# Altium project 绘蓝杯小闹钟.PrjPcb
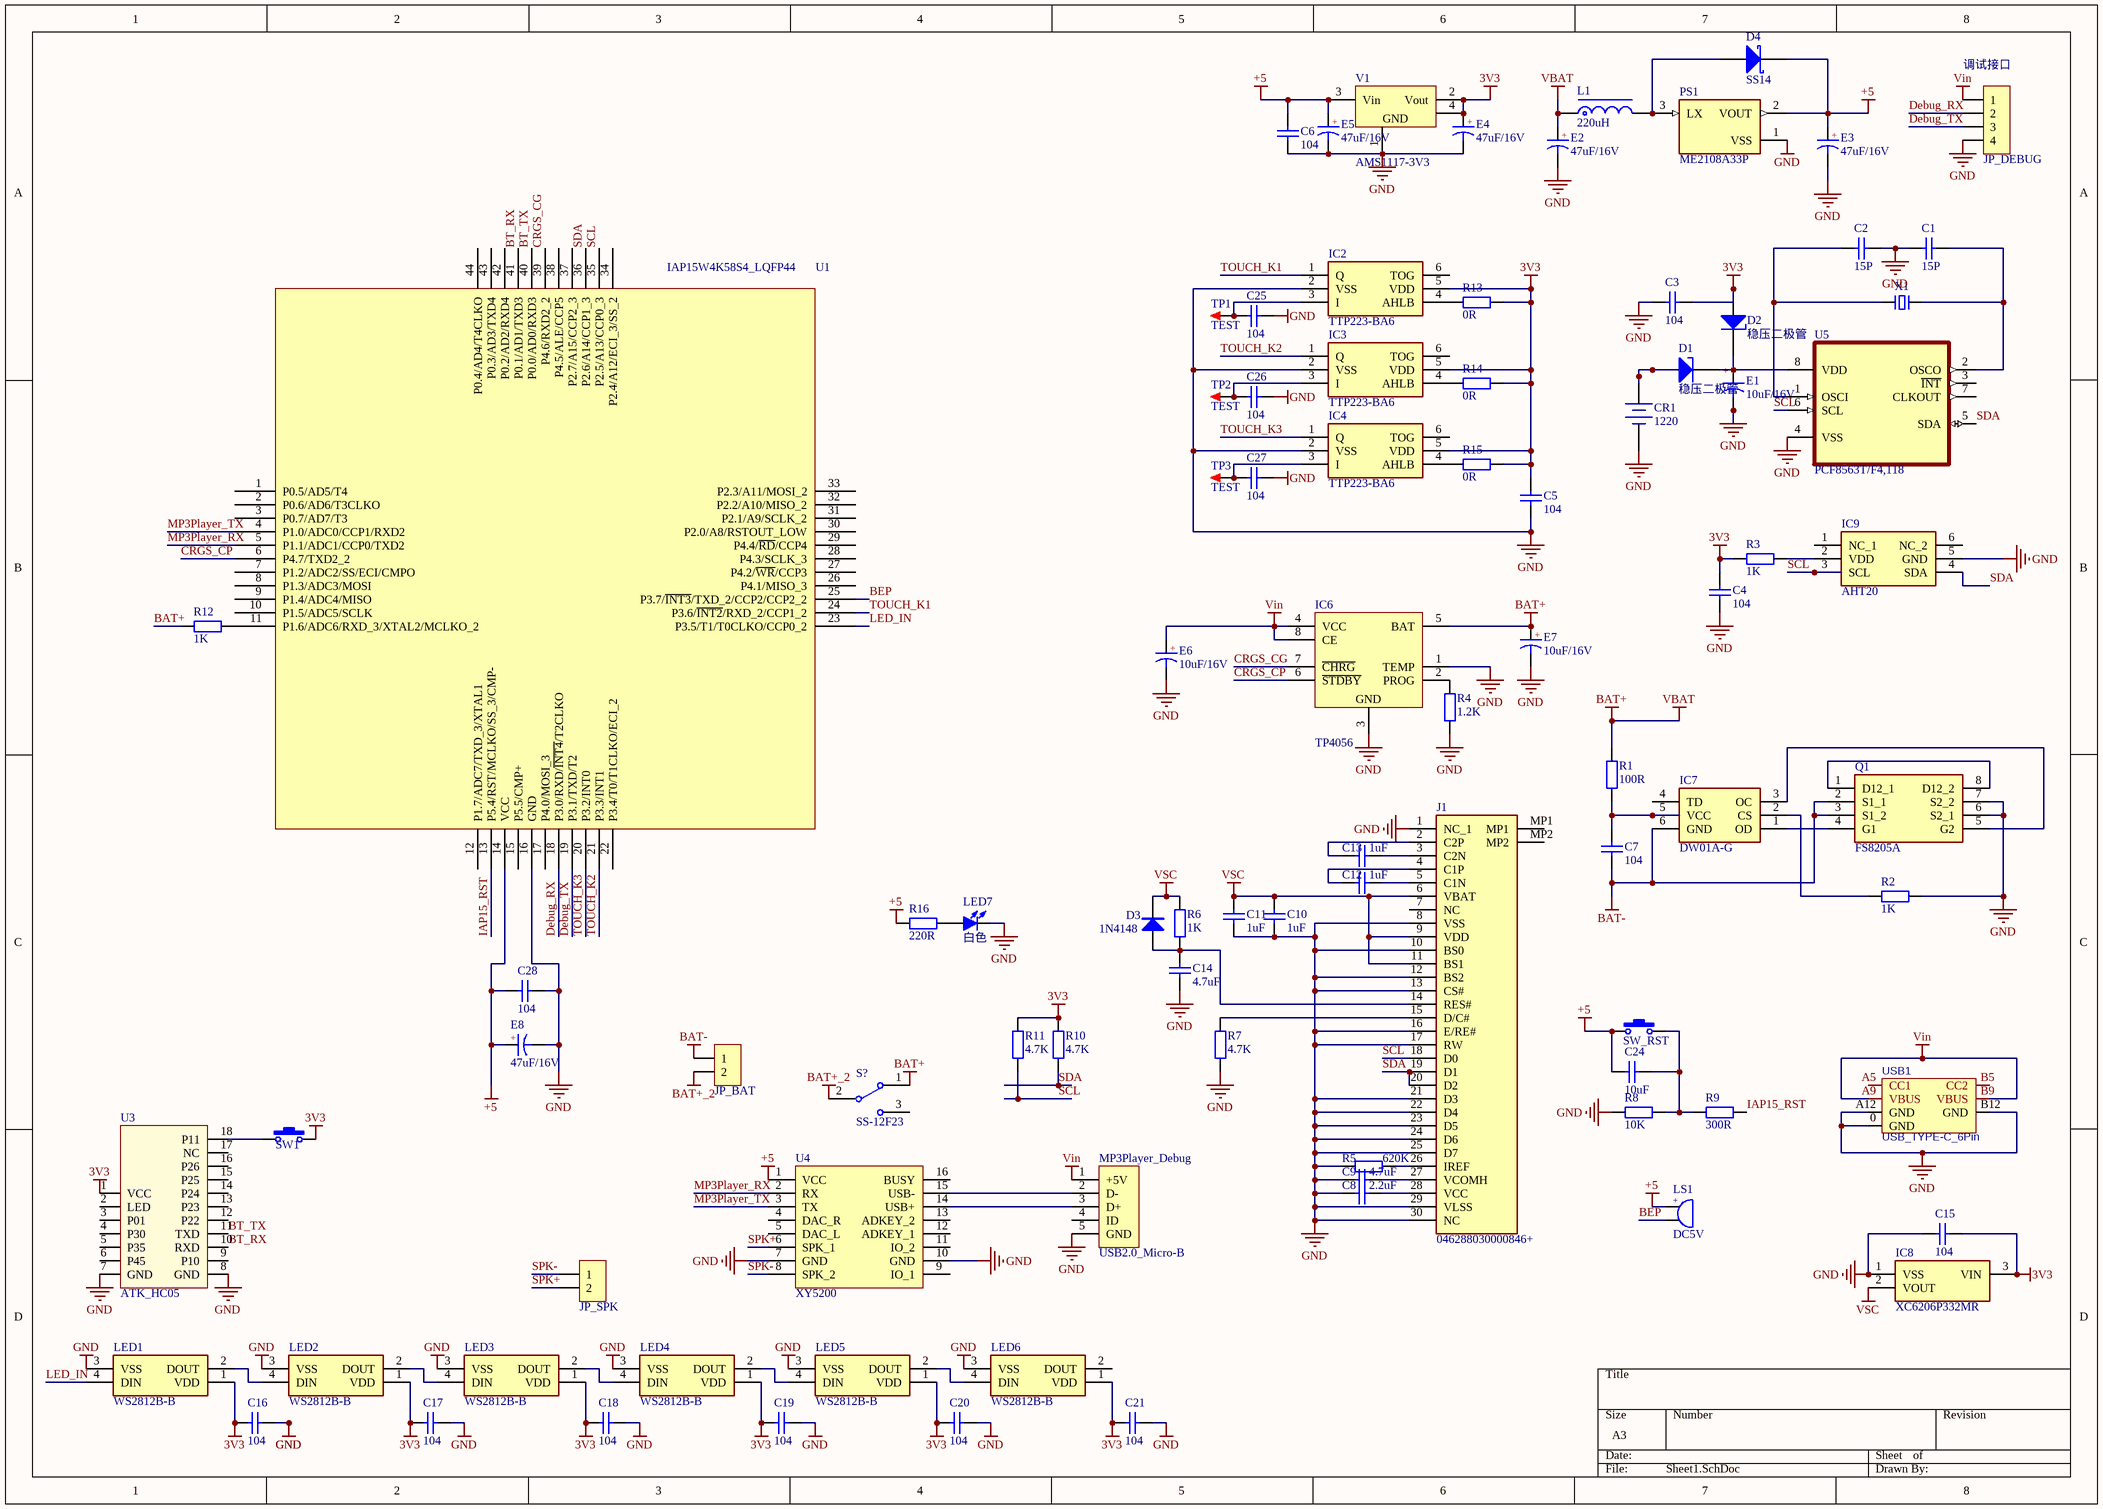
[diagram p0: Sheet1.SchDoc]
1 sheet, 91 parts. Net scope: global (net labels, ports and power ports of the same name join across sheets).
Board file: 删除机械层.PcbDoc

## Sheet Sheet1.SchDoc
size A3; SheetNumber: 1; SheetTotal: 1

### Parts
C1  15P  [C0805_L]
C2  15P  [C0805_L]
C3  104  [C0805_L]
C4  104  [C0805_L]
C5  104  [C0805_L]
C6  104  [C0805_L]
C7  104  [C0805_L]
C8  2.2uF  [C0805_L]
C9  4.7uF  [C0805_L]
C10  1uF  [C0805_L]
C11  1uF  [C0805_L]
C12  1uF  [C0805_L]
C13  1uF  [C0805_L]
C14  4.7uF  [C0805_L]
C15  104  [C0805_L]
C16  104  [C0805_L]
C17  104  [C0805_L]
C18  104  [C0805_L]
C19  104  [C0805_L]
C20  104  [C0805_L]
C21  104  [C0805_L]
C24  10uF  [C0805_L]
C25  104  [C0805_L]
C26  104  [C0805_L]
C27  104  [C0805_L]
C28  104  [C0805_L]
CR1  1220  [CR1220_A]
D1  稳压二极管  [SOD-123]
D2  稳压二极管  [SOD-123]
D3  1N4148  [MINI_MELF (LL34)]
D4  SS14  [SMA]
E1  10uF/16V  [CE B(4*5.4)]
E2  47uF/16V  [CE C(5*5.4)]
E3  47uF/16V  [CE C(5*5.4)]
E4  47uF/16V  [CE C(5*5.4)]
E5  47uF/16V  [CE C(5*5.4)]
E6  10uF/16V  [CE B(4*5.4)]
E7  10uF/16V  [CE B(4*5.4)]
E8  47uF/16V  [CE C(5*5.4)]
IC2  TTP223-BA6  [SOT95P285X126-6N]
IC3  TTP223-BA6  [SOT95P285X126-6N]
IC4  TTP223-BA6  [SOT95P285X126-6N]
IC6  TP4056  [SOIC-8_EP]
IC7  DW01A-G  [SOT95P280X135-6N]
IC8  XC6206P332MR  [SOT95P280X130-3N]
IC9  AHT20  [AHT20]
J1  046288030000846+  [046288030000846]
JP_BAT  HDR-1X2  [XH2.54-LI-2P]  (value not drawn)
JP_DEBUG  HDR-1X4  [HDR2.54-WI-4P]  (value not drawn)
JP_SPK  HDR-1X2  [XH2.54-LI-2P]  (value not drawn)
L1  220uH  [CD54]
LED1  WS2812B-B  [WS2812BB]
LED2  WS2812B-B  [WS2812BB]
LED3  WS2812B-B  [WS2812BB]
LED4  WS2812B-B  [WS2812BB]
LED5  WS2812B-B  [WS2812BB]
LED6  WS2812B-B  [WS2812BB]
LED7  白色  [LED0805_W]
LS1  DC5V  [BEEP 5x9x5.5]
MP3Player_Debug  USB2.0_Micro-B  [USB2.0_MICRO-B_4]
PS1  ME2108A33P  [CONV_ME2108A33P]
Q1  FS8205A  [SOP65P640X120-8N]
R1  100R  [R0805_L]
R2  1K  [R0805_L]
R3  1K  [R0805_L]
R4  1.2K  [R0805_L]
R5  620K  [R0805_L]
R6  1K  [R0805_L]
R7  4.7K  [R0805_L]
R8  10K  [R0805_L]
R9  300R  [R0805_L]
R10  4.7K  [R0805_L]
R11  4.7K  [R0805_L]
R12  1K  [R0805_L]
R13  0R  [R0805_L]
R14  0R  [R0805_L]
R15  0R  [R0805_L]
R16  220R  [R0805_L]
S?  SS-12F23  [MSK-12C01-07]
SW1  3x6x5  [SW SMD-3*6*2.5]  (value not drawn)
SW_RST  3x6x5  [SW SMD-3*6*2.5]  (value not drawn)
TP1  TEST  [TEST 1.6]
TP2  TEST  [TEST 1.6]
TP3  TEST  [TEST 1.6]
U1  IAP15W4K58S4_LQFP44  [LQFP44]
U3  ATK_HC05  [ATK_HC05]
U4  XY5200  [DFPlayer Mini]
U5  PCF8563T/F4,118  [SOIC127P600X175-8N]
USB1  USB_TYPE-C_6Pin  [USB-C-SMD_6P]
V1  AMS1117-3V3  [SOT223_L]
X1  (no value)  [XTAL-3215-2P]

### Nets
3V3: C3.2 C4.2 C5.2 C15.2 C16.1 C17.1 C18.1 C19.1 C20.1 C21.1 D2.1(A) E4.1 IC2.5(VDD) IC3.5(VDD) IC4.5(VDD) IC8.3(VIN) LED1.1(VDD) LED2.1(VDD) LED3.1(VDD) LED4.1(VDD) LED5.1(VDD) LED6.1(VDD) R3.1 R10.2 R11.2 R13.2 R14.2 R15.2 SW1.2 U3.1(VCC) V1.2(Vout) V1.4(GND)
+5: C6.2 C24.1 C28.1 D4.2(K) E3.1 E5.1 E8.1 LS1.1 PS1.2(VOUT) R16.1 SW_RST.1 U1.14(VCC) U4.1(VCC) V1.3(Vin)
BAT+: E2.1 E7.1 IC6.5(BAT) L1.1 R1.2 R12.1 S?.1  [also labelled VBAT]
BAT+_2: JP_BAT.2 S?.2
BAT-: C7.1 IC7.6(GND) JP_BAT.1 Q1.2(S1_1) Q1.3(S1_2)
GND: C1.1 C2.2 C3.1 C4.1 C5.1 C6.1 C8.1 C9.1 C10.1 C11.1 C14.1 C15.1 C16.2 C17.2 C18.2 C19.2 C20.2 C21.2 C25.2 C26.2 C27.2 C28.2 CR1.2(DC-) E1.2 E2.2 E3.2 E4.2 E5.2 E6.2 E7.2 E8.2 IC2.2(VSS) IC3.2(VSS) IC4.2(VSS) IC6.1(TEMP) IC6.3(GND) IC8.1(VSS) IC9.5(GND) J1.1(NC_1) J1.8(VSS) J1.10(BS0) J1.12(BS2) J1.13(CS#) J1.16(E/RE#) J1.17(RW) J1.21(D3) J1.22(D4) J1.23(D5) J1.24(D6) J1.25(D7) J1.29(VLSS) J1.30(NC) JP_DEBUG.4 LED1.3(VSS) LED2.3(VSS) LED3.3(VSS) LED4.3(VSS) LED5.3(VSS) LED6.3(VSS) LED7.2(K) MP3Player_Debug.5(GND) PS1.1(VSS) Q1.6(S2_1) Q1.7(S2_2) R2.2 R4.1 R5.1 R7.1 R8.1 U1.16(GND) U3.7(GND) U3.8(GND) U4.7(GND) U4.10(GND) U5.4(VSS) USB1.0(GND) USB1.A12(GND) USB1.B12(GND) V1.1(GND)
Vin: E6.1 IC6.4(VCC) IC6.8(CE) JP_DEBUG.1 MP3Player_Debug.1(+5V) USB1.A9(VBUS) USB1.B9(VBUS)
VSC: C10.2 C11.2 D3.2(K) IC8.2(VOUT) J1.6(VBAT) J1.9(VDD) J1.11(BS1) R6.2
BEP: LS1.2 U1.25(P3.7/~{INT3}/TXD_2/CCP2/CCP2_2)
BT_RX: U1.41(P0.1/AD1/TXD3) U3.10(RXD)
BT_TX: U1.40(P0.0/AD0/RXD3) U3.11(TXD)
CRGS_CG: IC6.7(~{CHRG}) U1.39(P4.6/RXD2_2)
CRGS_CP: IC6.6(~{STDBY}) U1.6(P4.7/TXD2_2)
Debug_RX: JP_DEBUG.2 U1.18(P3.0/RXD/~{INT4}/T2CLKO)
Debug_TX: JP_DEBUG.3 U1.19(P3.1/TXD/T2)
IAP15_RST: R9.2 U1.13(P5.4/RST/MCLKO/SS_3/CMP-)
LED_IN: LED1.4(DIN) U1.23(P3.5/T1/T0CLKO/CCP0_2)
MP3Player_RX: U1.5(P1.1/ADC1/CCP0/TXD2) U4.2(RX)
MP3Player_TX: U1.4(P1.0/ADC0/CCP1/RXD2) U4.3(TX)
SCL: IC9.3(SCL) J1.18(D0) R11.1 U1.35(P2.5/A13/CCP0_3) U5.6(SCL)
SDA: IC9.4(SDA) J1.19(D1) J1.20(D2) R10.1 U1.36(P2.6/A14/CCP1_3) U5.5(SDA)
SPK+: JP_SPK.2 U4.6(SPK_1)
SPK-: JP_SPK.1 U4.8(SPK_2)
TOUCH_K1: IC2.1(Q) U1.24(P3.6/~{INT2}/RXD_2/CCP1_2)
TOUCH_K2: IC3.1(Q) U1.21(P3.3/INT1)
TOUCH_K3: IC4.1(Q) U1.20(P3.2/INT0)
NetC1_2: C1.2 U5.2(OSCO) X1.2
NetC2_1: C2.1 U5.1(OSCI) X1.1
NetC7_2: C7.2 IC7.5(VCC) R1.1
NetC8_2: C8.2 J1.28(VCC)
NetC9_2: C9.2 J1.27(VCOMH)
NetC12_1: C12.1 J1.4(C1P)
NetC12_2: C12.2 J1.5(C1N)
NetC13_1: C13.1 J1.2(C2P)
NetC13_2: C13.2 J1.3(C2N)
NetC14_2: C14.2 D3.1(A) J1.14(RES#) R6.1
NetC24_2: C24.2 R8.2 R9.1 SW_RST.2
NetC25_1: C25.1 IC2.3(I) TP1.1
NetC26_1: C26.1 IC3.3(I) TP2.1
NetC27_1: C27.1 IC4.3(I) TP3.1
NetCR1_1: CR1.1(DC+) D1.1(A)
NetD1_2: D1.2(K) D2.2(K) E1.1 U5.8(VDD)
NetD4_1: D4.1(A) L1.2 PS1.3(LX)
NetIC2_4: IC2.4(AHLB) R13.1
NetIC3_4: IC3.4(AHLB) R14.1
NetIC4_4: IC4.4(AHLB) R15.1
NetIC6_2: IC6.2(PROG) R4.2
NetIC7_1: IC7.1(OD) Q1.4(G1)
NetIC7_2: IC7.2(CS) R2.1
NetIC7_3: IC7.3(OC) Q1.5(G2)
NetIC9_2: IC9.2(VDD) R3.2
NetJ1_15: J1.15(D/C#) R7.2
NetJ1_26: J1.26(IREF) R5.2
NetLED1_2: LED1.2(DOUT) LED2.4(DIN)
NetLED2_2: LED2.2(DOUT) LED3.4(DIN)
NetLED3_2: LED3.2(DOUT) LED4.4(DIN)
NetLED4_2: LED4.2(DOUT) LED5.4(DIN)
NetLED5_2: LED5.2(DOUT) LED6.4(DIN)
NetLED7_1: LED7.1(A) R16.2
NetMP3Player_Debug_2: MP3Player_Debug.2(D-) U4.15(USB-)
NetMP3Player_Debug_3: MP3Player_Debug.3(D+) U4.14(USB+)
NetQ1_1: Q1.1(D12_1) Q1.8(D12_2)
NetR12_2: R12.2 U1.11(P1.6/ADC6/RXD_3/XTAL2/MCLKO_2)
NetSW1_1: SW1.1 U3.18(P11)

Not connected (* = marked no-connect by the designer): IC2 6(TOG); IC3 6(TOG); IC4 6(TOG); IC7 4(TD); IC9 1(NC_1) 6(NC_2); J1 7(NC) MP1 MP2; LED6 2(DOUT); MP3Player_Debug 4(ID); S? 3; U1 1(P0.5/AD5/T4) 2(P0.6/AD6/T3CLKO) 3(P0.7/AD7/T3) 7(P1.2/ADC2/SS/ECI/CMPO) 8(P1.3/ADC3/MOSI) 9(P1.4/ADC4/MISO) 10(P1.5/ADC5/SCLK) 12(P1.7/ADC7/TXD_3/XTAL1) 15(P5.5/CMP+) 17(P4.0/MOSI_3) 22(P3.4/T0/T1CLKO/ECI_2) 26(P4.1/MISO_3) 27(P4.2/~{WR}/CCP3) 28(P4.3/SCLK_3) 29(P4.4/~{RD}/CCP4) 30(P2.0/A8/RSTOUT_LOW) 31(P2.1/A9/SCLK_2) 32(P2.2/A10/MISO_2) 33(P2.3/A11/MOSI_2) 34(P2.4/A12/ECI_3/SS_2) 37(P2.7/A15/CCP2_3) 38(P4.5/ALE/CCP5) 42(P0.2/AD2/RXD4) 43(P0.3/AD3/TXD4) 44(P0.4/AD4/T4CLKO); U3 2(LED) 3(P01) 4(P30) 5(P35) 6(P45) 9(P10) 12(P22) 13(P23) 14(P24) 15(P25) 16(P26) 17(NC); U4 4(DAC_R) 5(DAC_L) 9(IO_1) 11(IO_2) 12(ADKEY_1) 13(ADKEY_2) 16(BUSY); U5 3(~{INT}) 7(CLKOUT); USB1 A5(CC1) B5(CC2)

### Notes on the sheet
- (near JP_DEBUG) 调试接口
- (in symbol BEEP) +
- (in symbol CE_SMD) +

### Library data of the parts
C1-C21 C24-C28 = C: 贴片电容; BOM名称: 无极性贴片电容; 联系卖家，免费查找封装: 唯一出售店铺网址https://shop463601444.taobao.com
CR1 = CR-3V: 微型电池; 联系卖家，免费查找封装: 唯一出售店铺网址https://shop463601444.taobao.com; 封装库来自淘宝卖家ID：黄晶宝石: 其他店铺购入均为盗版假冒封装库，请立即申请退款; BOM名称: 微型电池
D1 D2 = 稳压二极管: Zener Diode; 联系卖家，免费查找封装: 唯一出售店铺网址https://shop463601444.taobao.com
D3 = 1N4148: 开关二极管; BOM名称: 高速开关二极管; 联系卖家，免费查找封装: 唯一出售店铺网址https://shop463601444.taobao.com
D4 = SS14: 肖特基二极管; 属性: 40V/1A; 联系卖家，免费查找封装: 唯一出售店铺网址https://shop463601444.taobao.com; BOM名称: 肖特基二极管
E1-E8 = CE_SMD: 贴片电解电容; 联系卖家，免费查找封装: 唯一出售店铺网址https://shop463601444.taobao.com; BOM名称: 贴片电解电容
IC2-IC4 = TTP223-BA6: Integrated Circuit; Manufacturer_Name: TONTEK; Datasheet Link: https://radiokot.ru/konkursCatDay2014/53/01.pdf; Height: 1.26mm; Manufacturer_Part_Number: TTP223-BA6
IC6 = TP4056: 锂电池充电管理; 封装库来自淘宝卖家 ID：黄晶宝石: 其他店铺购入均为盗版，请立即申请退款，本店现金奖励5~20元; 联系卖家 免费查找封装: 唯一出售店铺网址https://shop463601444.taobao.com; BOM名称: 锂电池充电管理
IC7 = DW01A-G: Integrated Circuit; Manufacturer_Name: Fortune Semiconductor Corporation; Datasheet Link: http://acoptex.com/uploads/DW01A.pdf; Height: 1.35mm; Manufacturer_Part_Number: DW01A-G
IC8 = XC6206P332MR: Integrated Circuit; Manufacturer_Name: Torex; Datasheet Link: http://www.torexsemi.com/products/voltage_regulators/data/XC6206.pdf; Height: 1.3mm; Manufacturer_Part_Number: XC6206P332MR
IC9 = AHT20: Integrated Circuit; Manufacturer_Name: Adafruit; Datasheet Link: https://cdn-learn.adafruit.com/assets/assets/000/091/676/original/AHT20-datasheet-2020-4-16.pdf?1591047915; Height: 1.1mm; Manufacturer_Part_Number: AHT20
J1 = 046288030000846+: Connector; Manufacturer_Name: Kyocera Electronic Components; Datasheet Link: https://global.kyocera.com/prdct/electro/product/pdf/6288.pdf; Height: 2.15mm; Manufacturer_Part_Number: 046288030000846+; Mouser Part Number: 581-046288030000846+; Mouser Price/Stock: https://www.mouser.co.uk/ProductDetail/Kyocera-Electronic-Components/046288030000846%2b?qs=HmNO9%252B%2F6HD5kPR%2FYbA40zA%3D%3D
JP_BAT JP_SPK = Header 2: 2P接插件; 封装库来自淘宝卖家 ID：黄晶宝石: 其他店铺购入均为盗版假冒封装库; 联系卖家，免费查找封装: 唯一出售店铺网址https://shop463601444.taobao.com; BOM名称: 2P接插件
JP_DEBUG = Header 4: 4P接插件; 封装库来自淘宝卖家 ID：黄晶宝石: 其他店铺购入均为盗版假冒封装库; 联系卖家，免费查找封装: 唯一出售店铺网址https://shop463601444.taobao.com; BOM名称: 4P接插件
L1 = L-SMD: CD系列贴片线绕功率电感; BOM名称: 功率电感; 联系卖家，免费查找封装: 唯一出售店铺网址https://shop463601444.taobao.com
LED1-LED6 = WS2812B-B: LED; Manufacturer_Name: Worldsemi; Datasheet Link: http://www.world-semi.com/DownLoadFile/111; Height: 1.62mm; Manufacturer_Part_Number: WS2812B-B
LED7 = LED-SMD: 贴片LED; 联系卖家 免费查找封装: 封装库来自淘宝卖家ID：黄晶宝石; BOM名称: 贴片LED
LS1 = BEEP: 蜂鸣器; 联系卖家，免费查找封装: 唯一出售店铺网址https://shop463601444.taobao.com; 封装库来自淘宝卖家ID：黄晶宝石: 其他店铺购入均为盗版假冒封装库，请立即申请退款; BOM名称: 蜂鸣器
MP3Player_Debug = USB2.0_Micro-B: USB2.0_Micro-B母座; 联系卖家 免费查找封装: 唯一出售店铺网址https://shop463601444.taobao.com; 联系卖家 免费技术支持: 封装库来自淘宝卖家ID：黄晶宝石; BOM名称: USB2.0_Micro-B母座
PS1 = ME2108A33P: PFM Step-up Step-up Step-up Step-up DC/DC Converter; MF: Nanjing Micro One Electronics; Price: None; SnapEDA_Link: https://www.snapeda.com/parts/ME2108A33P/Nanjing%20Micro%20One%20Electronics/view-part/4258047/?ref=snap; MP: ME2108A33P; Value: *; Availability: Unavailable; Package: Package; Check_prices: https://www.snapeda.com/parts/ME2108A33P/Nanjing%20Micro%20One%20Electronics/view-part/4258047/?ref=eda
Q1 = FS8205A: MOSFET (N-Channel); Manufacturer_Name: fortune; Datasheet Link: http://www.ic-fortune.com/upload/Download/FS8205A-DS-12_EN.pdf; Height: 1.2mm; Manufacturer_Part_Number: FS8205A
R1-R16 = R: 贴片电阻; 联系卖家，免费查找封装: 唯一出售店铺网址https://shop463601444.taobao.com; BOM名称: 贴片电阻
S? = SSW-1P: 1路波动开关; BOM名称: 波动开关; 联系卖家，免费查找封装: 唯一出售店铺网址https://shop463601444.taobao.com; 封装库来自淘宝卖家ID：黄晶宝石: 其他店铺购入均为盗版假冒封装库，请立即申请退款
SW1 SW_RST = SW 3x6: 3x6轻触开关; 联系卖家，免费查找封装: 唯一出售店铺网址https://shop463601444.taobao.com; 封装库来自淘宝卖家ID：黄晶宝石: 其他店铺购入均为盗版假冒封装库，请立即申请退款; BOM名称: 3x6轻触开关
TP1-TP3 = TEST: 测试点; 联系卖家，免费查找封装: 唯一出售店铺网址https://shop463601444.taobao.com; 封装库来自淘宝卖家ID：黄晶宝石: 其他店铺购入均为盗版假冒封装库，请立即申请退款; BOM名称: 测试点
U1 = STC15W4K60S4_LQFP44
U3 = ATK_HC05: 蓝牙模块; 联系卖家，免费查找封装: 唯一出售店铺网址https://shop463601444.taobao.com
U4 = Mini MP3 Player: MP3模块; 卖家免费技术支持，联系售后: 唯一出售店铺网址https://shop463601444.taobao.com; BOM名称: MP3模块
U5 = PCF8563T/F4,118: Real Time Clock (RTC) IC Clock/Calendar IÂ²C, 2-Wire Serial 8-SOIC (0.154, 3.90mm Width); MF: NXP USA; Value: *; Price: None; Check_prices: https://www.snapeda.com/parts/PCF8563T/F4,118/NXP%20USA%20Inc./view-part/32409/?ref=eda; Purchase-URL: https://pricing.snapeda.com/search/part/PCF8563T/F4,118/?ref=eda; MP: PCF8563T/F4,118; SnapEDA_Link: https://www.snapeda.com/parts/PCF8563T/F4,118/NXP%20USA%20Inc./view-part/32409/?ref=snap; Package: SOIC-8 NXP Semiconductors; Availability: Good
USB1 = USB_TYPE-C_6Pin: USB_TYPE-C_6Pin母座; 联系卖家 免费查找封装: 唯一出售店铺网址https://shop463601444.taobao.com; 联系卖家 免费技术支持: 封装库来自淘宝卖家ID：黄晶宝石
V1 = AMS1117: 三端稳压芯片; BOM名称: 稳压芯片; 封装库来自淘宝卖家 ID：黄晶宝石: 其他店铺购入均为盗版，请立即申请退款，本店现金奖励5~20元; 联系卖家 免费查找封装: 唯一出售店铺网址https://shop463601444.taobao.com
X1 = XTAL-2P: 2脚无源晶振(谐振器）; 联系卖家，免费查找封装: 唯一出售店铺网址https://shop463601444.taobao.com; BOM名称: 2脚无源晶振(谐振器）